# EAGLE schematic DataConvX13 (EAGLE 9.6.2)

## Sheet 1 of 3
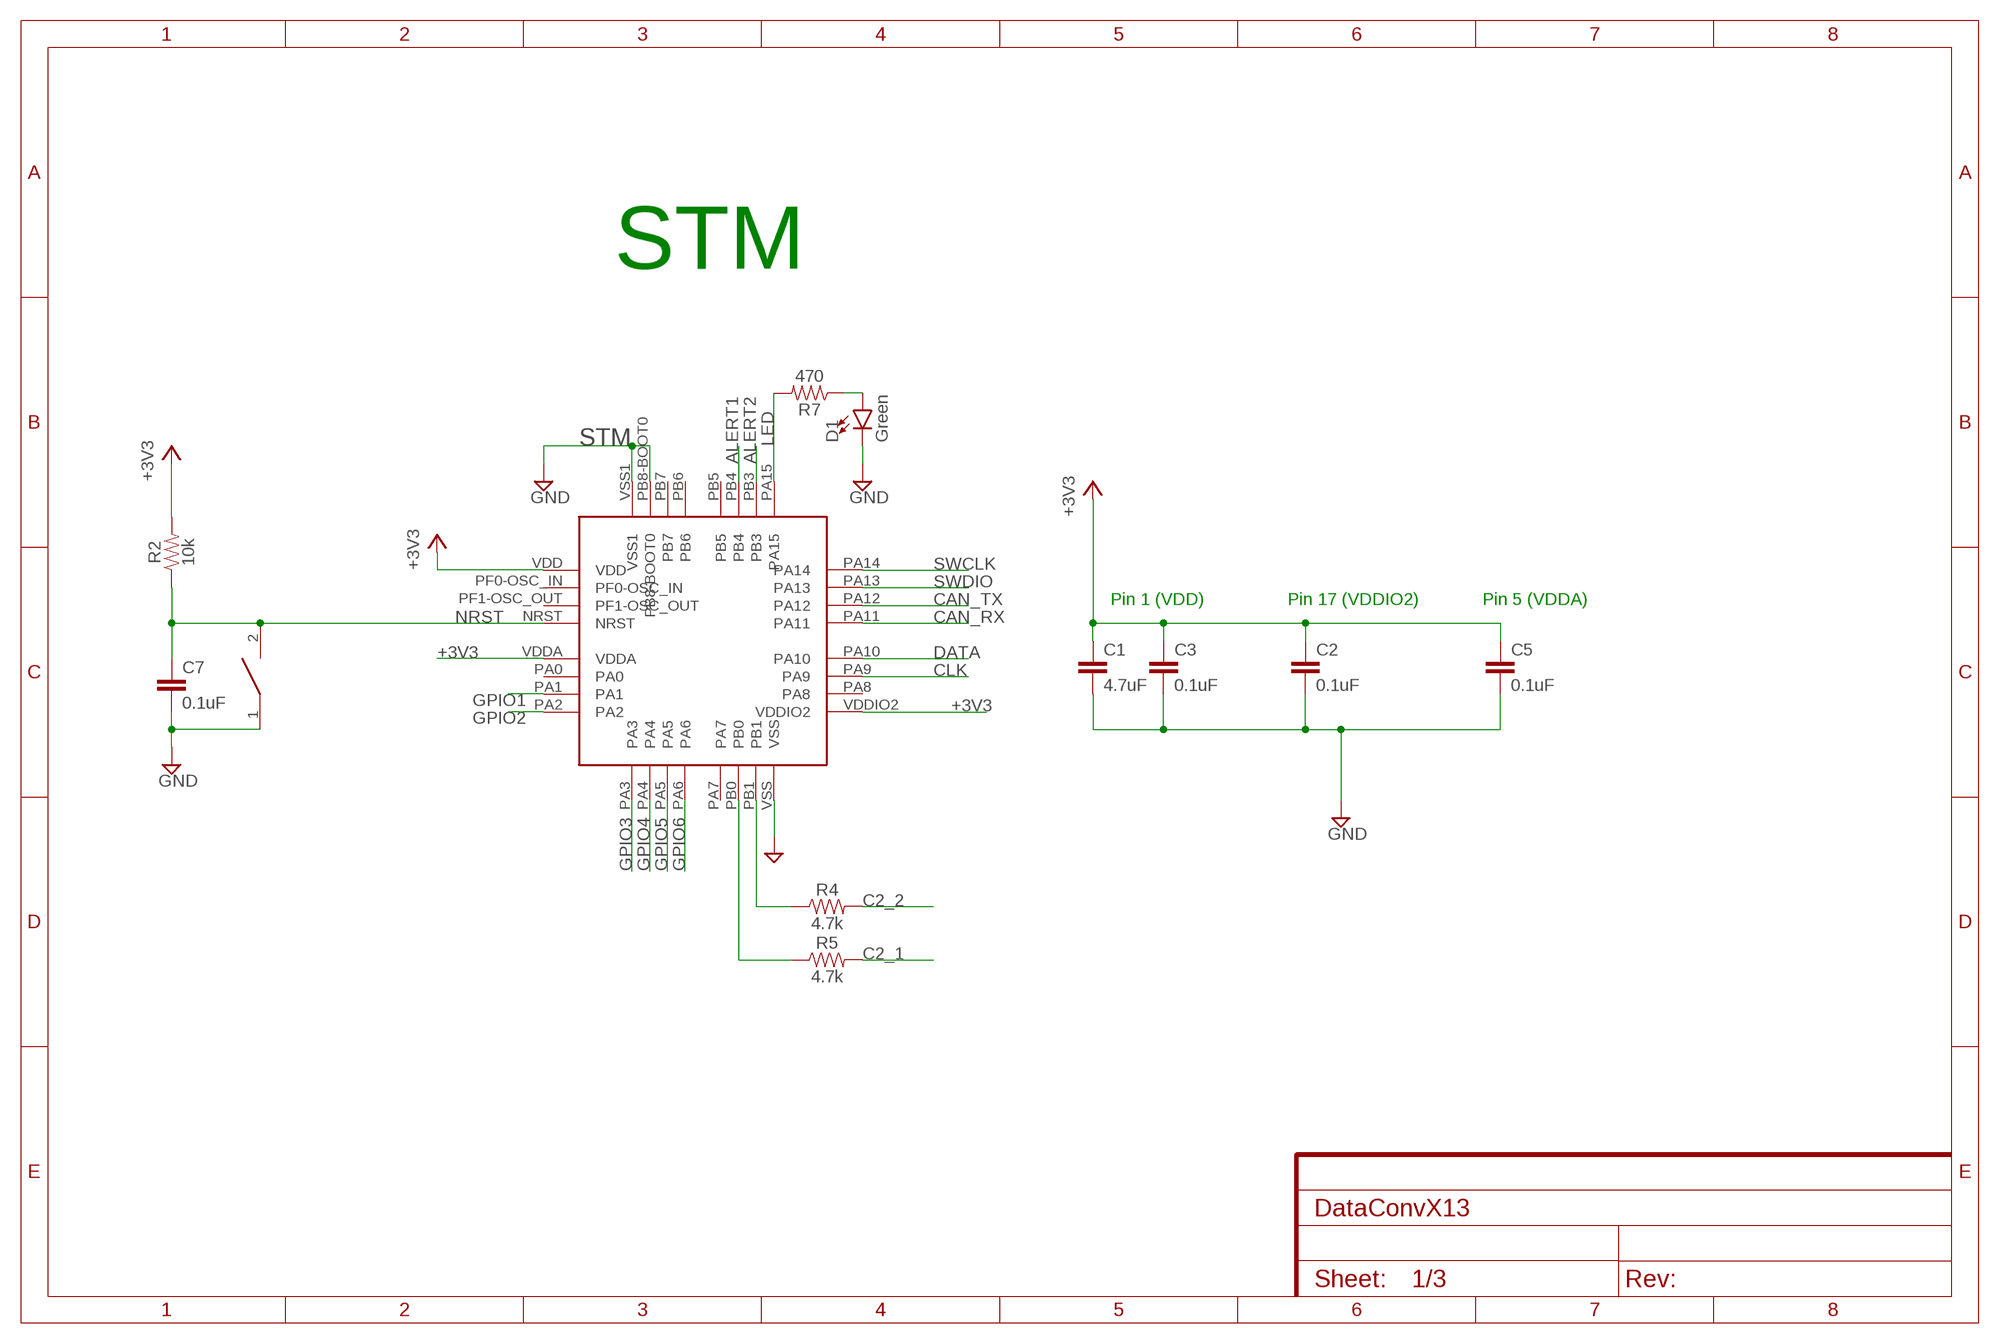
[diagram p0: schematic, sheet 1]

### Parts
C1  4.7uF  4.7UF0603  [0603]
C2  0.1uF  4.7UF0603  [0603]
C3  0.1uF  4.7UF0603  [0603]
C5  0.1uF  4.7UF0603  [0603]
C7  0.1uF  4.7UF0603  [0603]
D1  Green  LED0603  [LED-0603]
R2  10k  1KOHM-0603-1/10W-1%  [0603]
R4  4.7k  4.7KOHM-0603-1/10W-1%  [0603]
R5  4.7k  4.7KOHM-0603-1/10W-1%  [0603]
R7  470  RESISTOR0603  [0603]
RESET  DISCRETECOMPONENTS_SWITCH  [DISCRETECOMPONENTS_SW_2512]
STM  STM32F042K6T6  [STM32F042K6T6]

### Nets
+3V3: C1.1 C2.1 C3.1 C5.1 R2.2 STM.VDD STM.VDDA STM.VDDIO2 ; also sheet 2,3
ALERT1: STM.PB4 ; also sheet 3
ALERT2: STM.PB3 ; also sheet 3
C2_1: R5.2 ; also sheet 3
C2_2: R4.2 ; also sheet 3
CAN_RX: STM.PA11 ; also sheet 2
CAN_TX: STM.PA12 ; also sheet 2
CLK: STM.PA9 ; also sheet 3
DATA: STM.PA10 ; also sheet 3
GND: C1.2 C2.2 C3.2 C5.2 C7.2 D1.C RESET.1 STM.PB8-BOOT0 STM.VSS STM.VSS1 ; also sheet 2,3
GPIO1: STM.PA1 ; also sheet 3
GPIO2: STM.PA2 ; also sheet 3
GPIO3: STM.PA3 ; also sheet 3
GPIO4: STM.PA4 ; also sheet 3
GPIO5: STM.PA5 ; also sheet 3
GPIO6: STM.PA6 ; also sheet 3
LED: R7.2 STM.PA15
N$1: R4.1 STM.PB1
N$2: R5.1 STM.PB0
N$24: D1.A R7.1
NRST: C7.1 R2.1 RESET.2 STM.NRST ; also sheet 3
SWCLK: STM.PA14 ; also sheet 3
SWDIO: STM.PA13 ; also sheet 3
Unconnected: STM.PA0 STM.PA7 STM.PA8 STM.PB5 STM.PB6 STM.PB7 STM.PF0-OSC_IN STM.PF1-OSC_OUT

### Notes on the sheet
- STM
- Pin 1 (VDD) | Pin 17 (VDDIO2) | Pin 5 (VDDA)

## Sheet 2 of 3
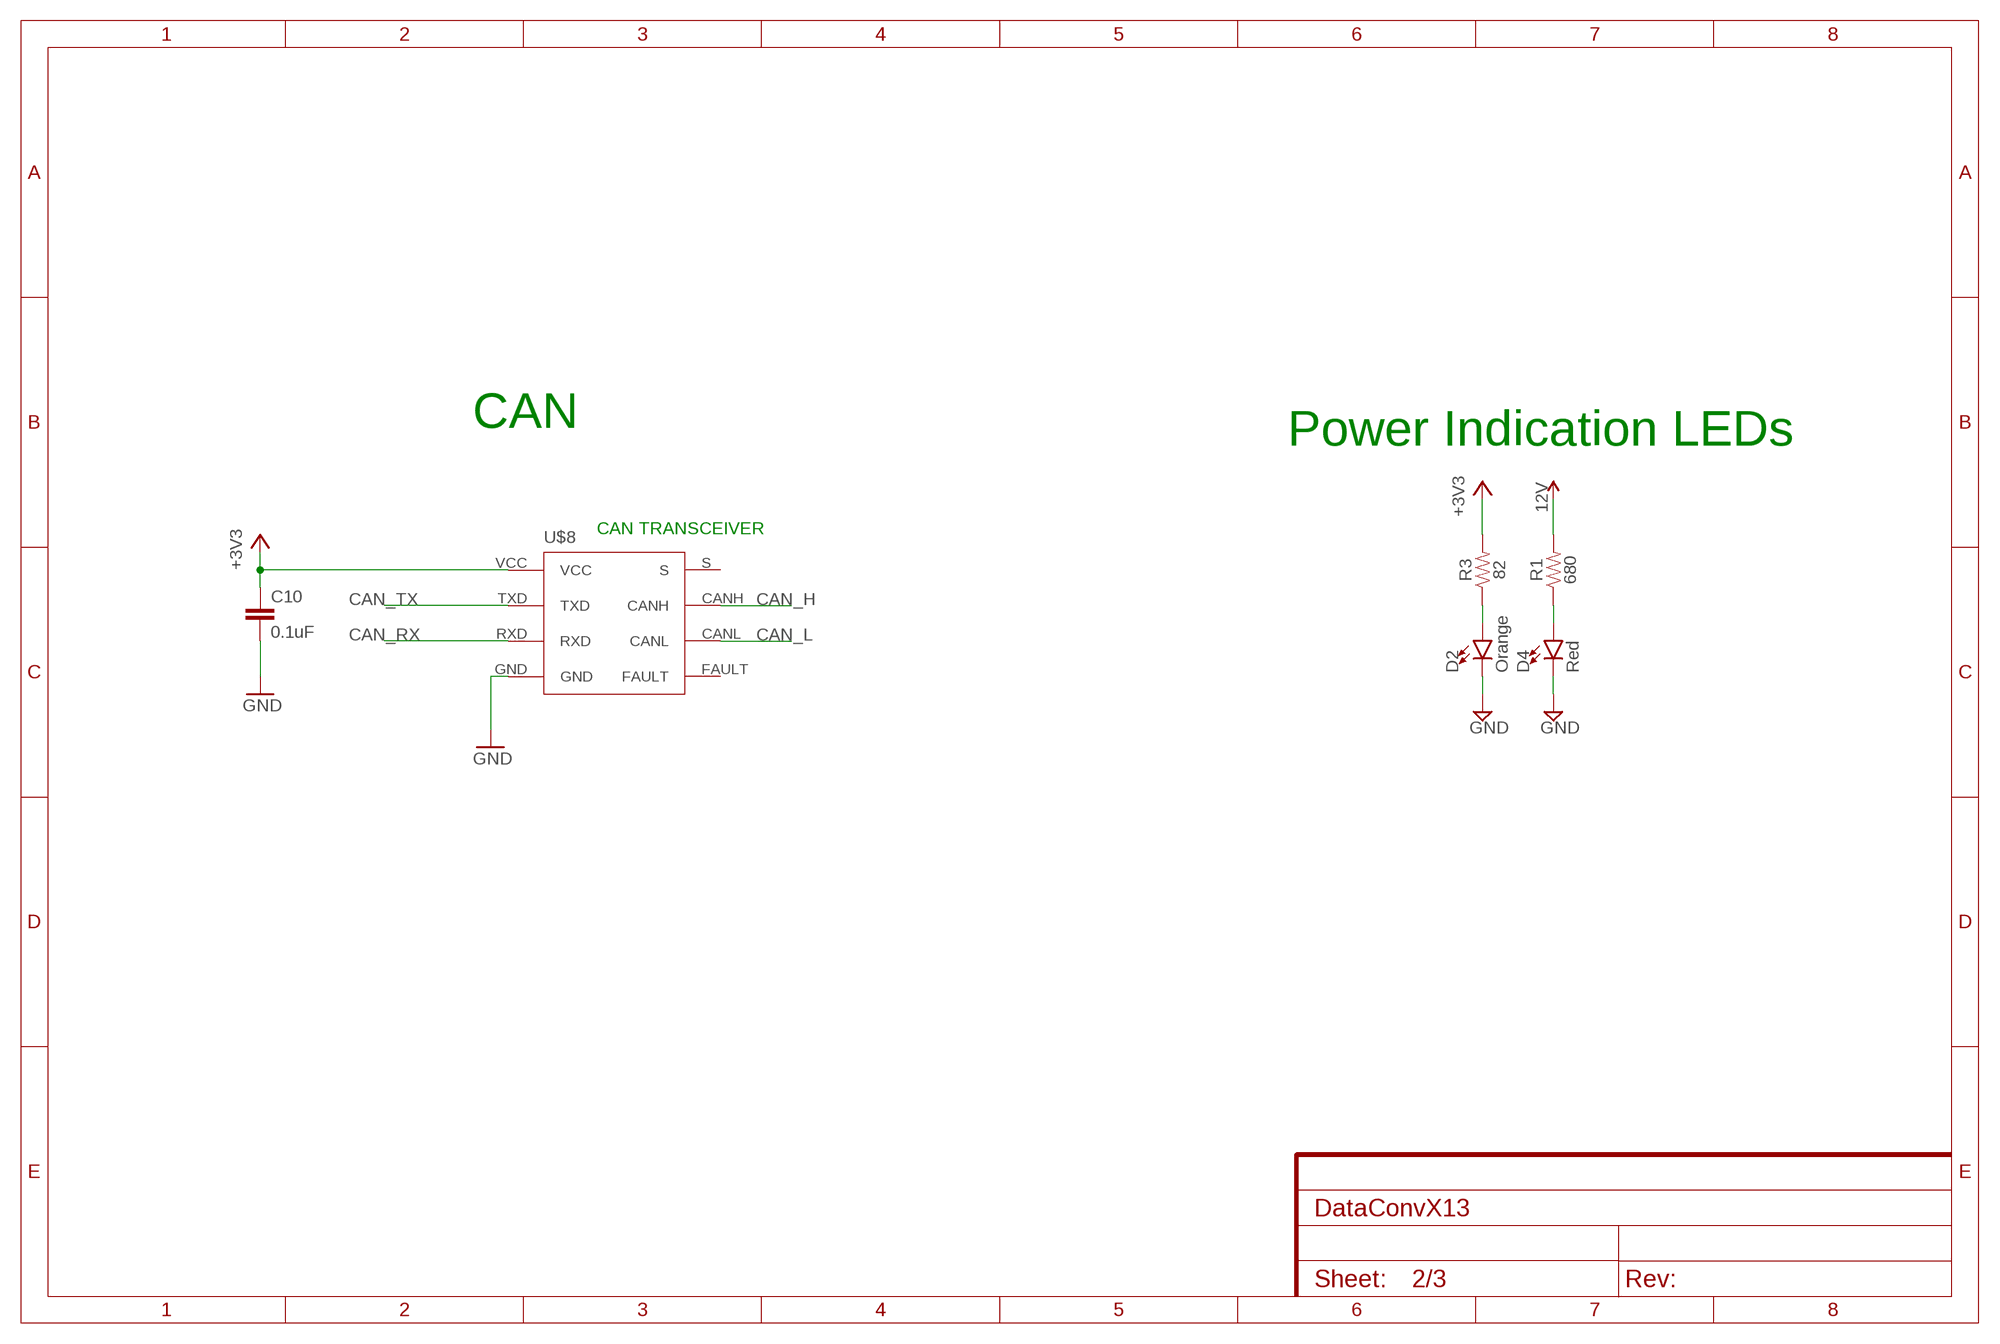
[diagram p1: schematic, sheet 2]

### Parts
C10  0.1uF  4.7UF0603  [0603]
D2  Orange  LED0603  [LED-0603]
D4  Red  LED0603  [LED-0603]
R1  680  680OHM-0603-1/10W-5%  [0603]
R3  82  82OHM-0603-1/10W-1%  [0603]
U$8  TCAN337D  [TCAN337D]

### Nets
12V: R1.2 ; also sheet 3
+3V3: C10.1 R3.2 U$8.VCC ; also sheet 1,3
CAN_H: U$8.CANH ; also sheet 3
CAN_L: U$8.CANL ; also sheet 3
CAN_RX: U$8.RXD ; also sheet 1
CAN_TX: U$8.TXD ; also sheet 1
GND: C10.2 D2.C D4.C U$8.GND ; also sheet 1,3
N$25: D4.A R1.1
N$27: D2.A R3.1
Unconnected: U$8.FAULT U$8.S

### Notes on the sheet
- CAN
- Power Indication LEDs
- CAN TRANSCEIVER

## Sheet 3 of 3
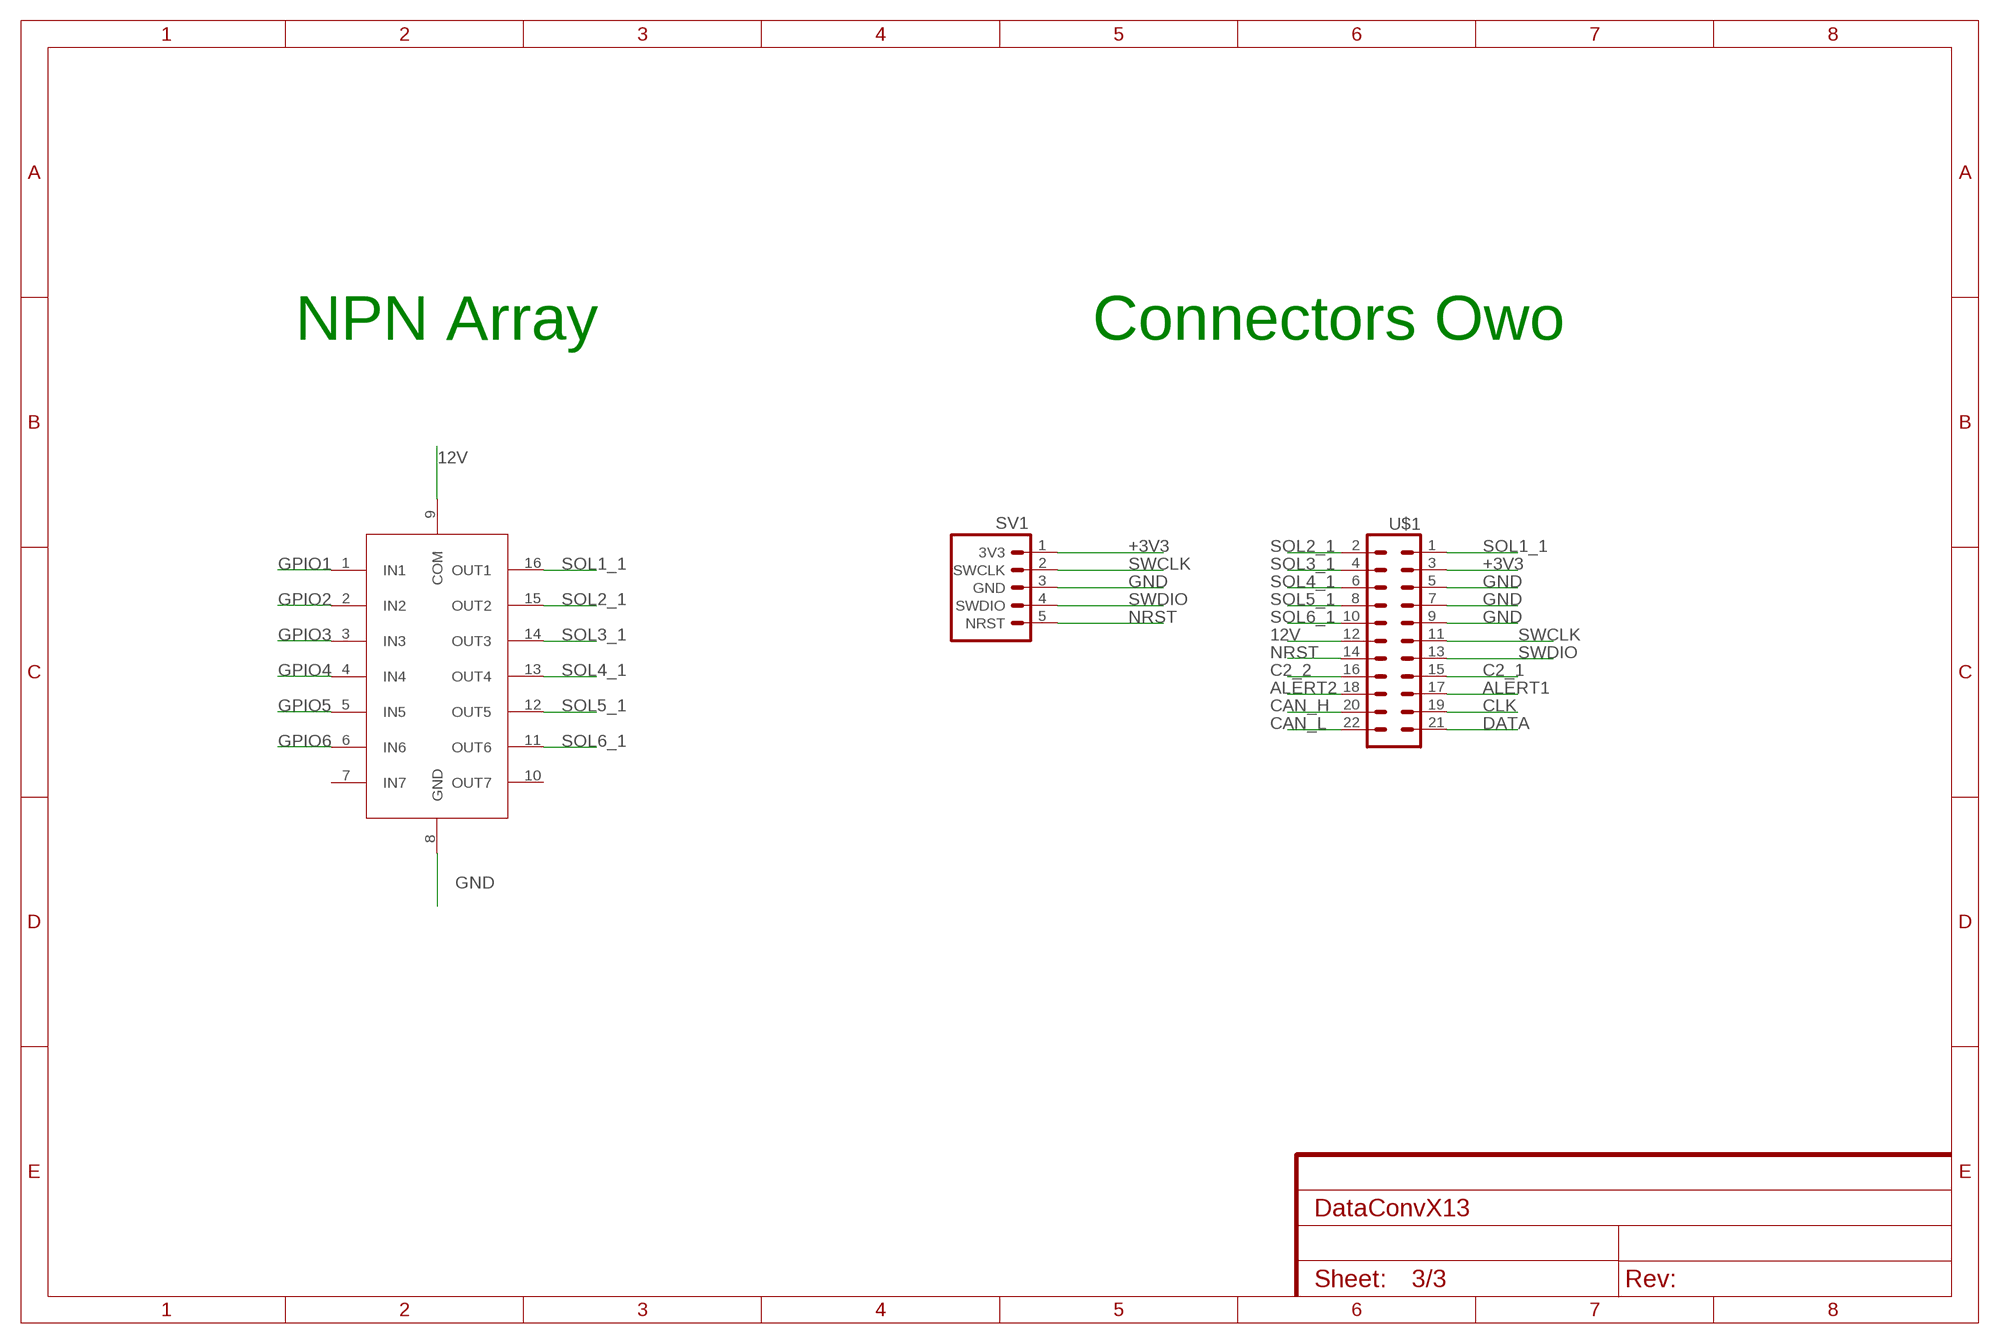
[diagram p2: schematic, sheet 3]

### Parts
SV1  3V3 -SWCLK-GND-SWDIO- NRST  SWD_CONN  [1X05]
U1  ULN2003V12  [ULN2003V12]
U$1  SOL-TO-BKP  [MMS-111-01-DV]

### Nets
12V: U1.9(COM) U$1.12 ; also sheet 2
+3V3: SV1.1(3V3) U$1.3 ; also sheet 1,2
ALERT1: U$1.17 ; also sheet 1
ALERT2: U$1.18 ; also sheet 1
C2_1: U$1.15 ; also sheet 1
C2_2: U$1.16 ; also sheet 1
CAN_H: U$1.20 ; also sheet 2
CAN_L: U$1.22 ; also sheet 2
CLK: U$1.19 ; also sheet 1
DATA: U$1.21 ; also sheet 1
GND: SV1.3(GND) U1.8(GND) U$1.5 U$1.7 U$1.9 ; also sheet 1,2
GPIO1: U1.1(IN1) ; also sheet 1
GPIO2: U1.2(IN2) ; also sheet 1
GPIO3: U1.3(IN3) ; also sheet 1
GPIO4: U1.4(IN4) ; also sheet 1
GPIO5: U1.5(IN5) ; also sheet 1
GPIO6: U1.6(IN6) ; also sheet 1
NRST: SV1.5(NRST) U$1.14 ; also sheet 1
SOL1_1: U1.16(OUT1) U$1.1
SOL2_1: U1.15(OUT2) U$1.2
SOL3_1: U1.14(OUT3) U$1.4
SOL4_1: U1.13(OUT4) U$1.6
SOL5_1: U1.12(OUT5) U$1.8
SOL6_1: U1.11(OUT6) U$1.10
SWCLK: SV1.2(SWCLK) U$1.11 ; also sheet 1
SWDIO: SV1.4(SWDIO) U$1.13 ; also sheet 1
Unconnected: U1.7(IN7) U1.10(OUT7)

### Notes on the sheet
- NPN Array | Connectors Owo

## Library data of the parts
C1 = SparkFun-Capacitors:4.7UF: 4.7µF ceramic capacitors A capacitor is a passive two-terminal electrical component used to store electrical energy temporarily in an electric field.; PROD_ID: CAP-08280
C2 C3 C5 C7 C10 = SparkFun-Capacitors:4.7UF: 4.7µF ceramic capacitors A capacitor is a passive two-terminal electrical component used to store electrical energy temporarily in an electric field.; PROD_ID: CAP-08280; VALUE: 4.7uF
D1 D2 D4 = SparkFun-LED:LED: LED (Generic) Standard schematic elements and footprints for 5mm, 3mm, 1206, and 0603 sized LEDs. Generic LEDs with no color specified.
R1 = SparkFun-Resistors:680OHM: 680Ω resistor A resistor is a passive two-terminal electrical component that implements electrical resistance as a circuit element. Resistors act to reduce current flow, and, at the same time, act to lower voltage levels within circuits. - Wikipedia; PROD_ID: RES-09333
R2 = SparkFun-Resistors:1KOHM: 1kΩ resistor A resistor is a passive two-terminal electrical component that implements electrical resistance as a circuit element. Resistors act to reduce current flow, and, at the same time, act to lower voltage levels within circuits. - Wikipedia; PROD_ID: RES-07856; VALUE: 1k
R3 = SparkFun-Resistors:82OHM: 82Ω resistor A resistor is a passive two-terminal electrical component that implements electrical resistance as a circuit element. Resistors act to reduce current flow, and, at the same time, act to lower voltage levels within circuits. - Wikipedia; PROD_ID: RES-12311
R4 R5 = SparkFun-Resistors:4.7KOHM: 4.7kΩ resistor A resistor is a passive two-terminal electrical component that implements electrical resistance as a circuit element. Resistors act to reduce current flow, and, at the same time, act to lower voltage levels within circuits. - Wikipedia; PROD_ID: RES-07857
R7 = SparkFun-Resistors:RESISTOR: Generic Resistor Package
RESET = Push button - FSM2JMTR:DISCRETECOMPONENTS_SWITCH: TE Connectivity FSM2JMTR Switch
STM = PI_Shield_Library:STM32F042K6T6
SV1 = CONN, Serial Wire Programming Headers:SWD_CONN
U1 = ULN2003V12:ULN2003V12; A1_MIN: 0.25; A_MAX: 1.75; A_MIN: 1.75; A_NOM: 1.75; B_MAX: 0.51; B_MIN: 0.33; B_NOM: 0.42; D2_MAX: 0.0; D_MAX: 10.0; D_MIN: 9.8; D_NOM: 9.9; E1_MAX: 4.0; E1_MIN: 3.8; E1_NOM: 3.9; E2_MAX: 0.0; ENOM: 1.27; E_MAX: 6.2; E_MIN: 5.8; E_NOM: 6.0; L_MAX: 1.27; L_MIN: 0.38; L_NOM: 0.825; MANUFACTURER: Diodes Inc.; PIN_COUNT: 16.0; SNAPEDA_PACKAGE_ID: 27538; STANDARD: IPC 7351B
U$1 = Solenoid-Backplane Connector:SOL-TO-BKP
U$8 = PI_Shield_Library:TCAN337D